# Altium schematic sheet 4GModule-EC25.SchDoc
size A2
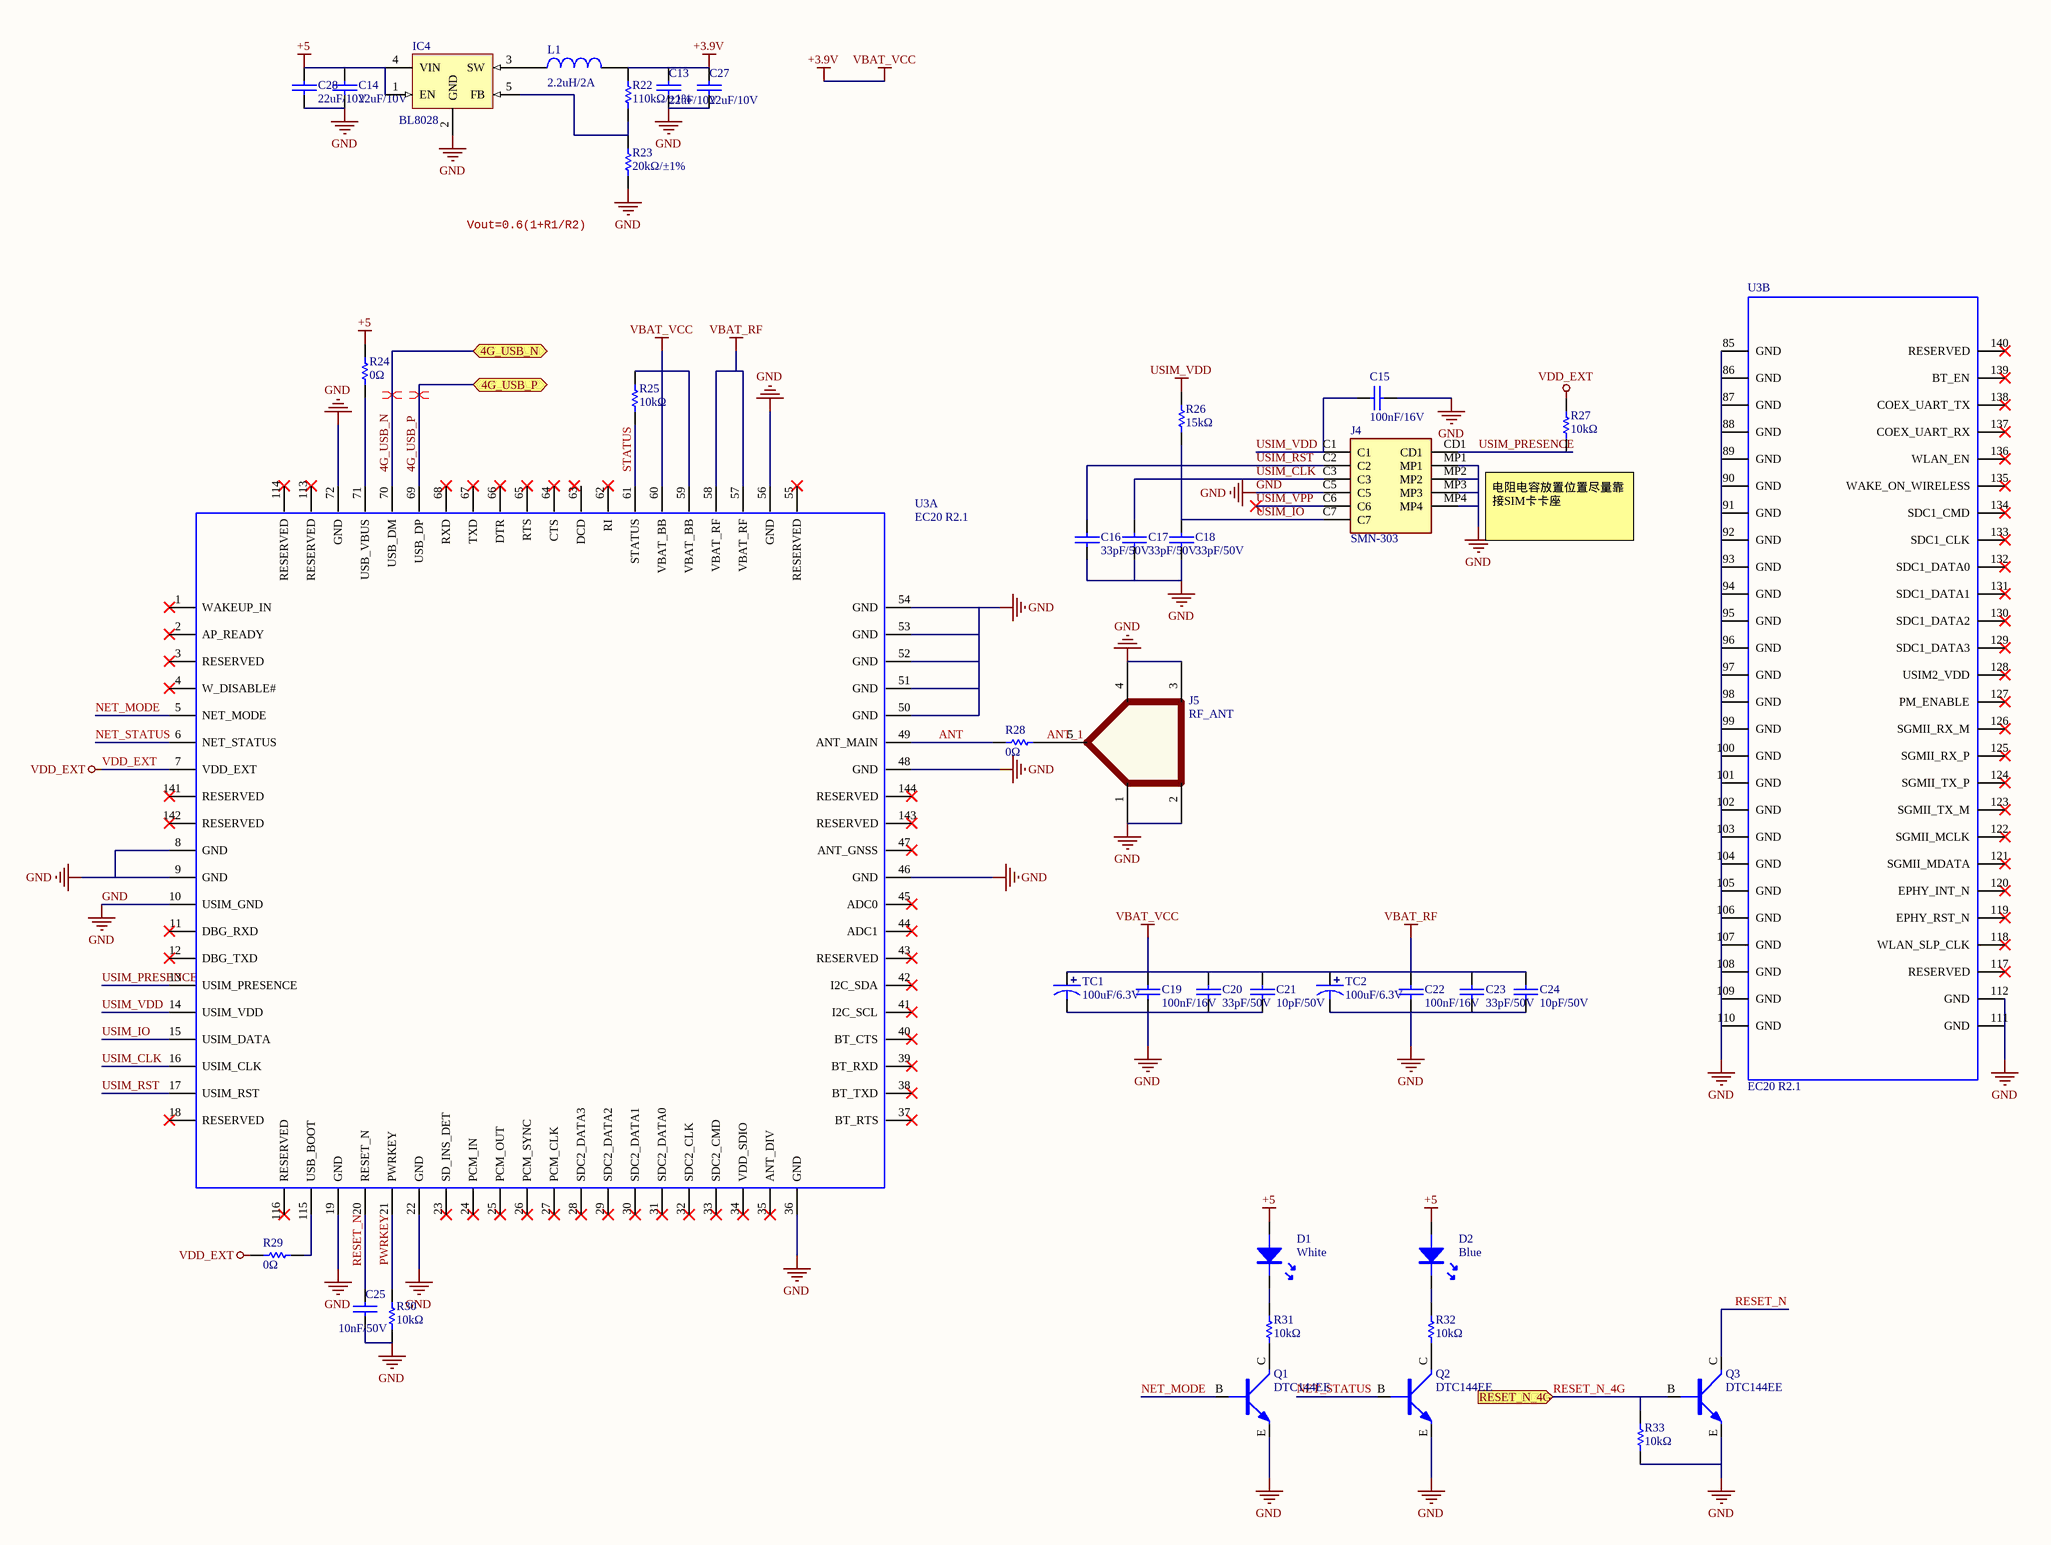
[diagram p0: 4GModule-EC25.SchDoc]

## Parts
C13  22uF/10V  [C_0603]
C14  22uF/10V  [C_0603]
C15  100nF/16V  [C_0402]
C16  33pF/50V  [C_0402]
C17  33pF/50V  [C_0402]
C18  33pF/50V  [C_0402]
C19  100nF/16V  [C_0402]
C20  33pF/50V  [C_0402]
C21  10pF/50V  [C_0402]
C22  100nF/16V  [C_0402]
C23  33pF/50V  [C_0402]
C24  10pF/50V  [C_0402]
C25  10nF/50V  [C_0402]
C27  22uF/10V  [C_0603]
C28  22uF/10V  [C_0603]
D1  White  [LED-0603-W]
D2  Blue  [LED-0603-B]
IC4  BL8028  [SOT23-5]
J4  SMN-303  [SimCard_SMN-303]
J5  RF_ANT  [RF_MCX]
L1  2.2uH/2A  [L_1008]
Q1  DTC144EE  [SOT-523]
Q2  DTC144EE  [SOT-523]
Q3  DTC144EE  [SOT-523]
R22  110kΩ/±1%  [R_0402]
R23  20kΩ/±1%  [R_0402]
R24  0Ω  [R_0402]
R25  10kΩ  [R_0402]
R26  15kΩ  [R_0402]
R27  10kΩ  [R_0402]
R28  0Ω  [R_0402]
R29  0Ω  [R_0402]
R30  10kΩ  [R_0402]
R31  10kΩ  [R_0402]
R32  10kΩ  [R_0402]
R33  10kΩ  [R_0402]
TC1  100uF/6.3V  [TAJ-B/3528]
TC2  100uF/6.3V  [TAJ-B/3528]
U3  EC20 R2.1  [LCC-144_29.0X32.0X1.3P]  (parts A,B of 2)

## Ports
4G_USB_N (bidir), 4G_USB_P (bidir), RESET_N_4G (in)

## Nets
+3.9V: C13.2 C19.2 C20.2 C21.2 C22.2 C23.2 C24.2 C27.2 L1.2 R22.2 R25.2 TC1.1 TC2.1 U3.57(VBAT_RF) U3.58(VBAT_RF) U3.59(VBAT_BB) U3.60(VBAT_BB)  [also labelled VBAT_RF, VBAT_VCC]
+5: C14.2 C28.2 D1.A D2.A IC4.1(EN) IC4.4(VIN) R24.2
GND: C13.1 C14.1 C15.1 C16.1 C17.1 C18.1 C19.1 C20.1 C21.1 C22.1 C23.1 C24.1 C25.1 C27.1 C28.1 IC4.2(GND) J4.C5 J4.MP1 J4.MP2 J4.MP3 J4.MP4 J5.1 J5.2 J5.3 J5.4 Q1.E Q2.E Q3.E R23.1 R30.1 R33.1 TC1.2 TC2.2 U3.8(GND) U3.9(GND) U3.10(USIM_GND) U3.19(GND) U3.22(GND) U3.36(GND) U3.46(GND) U3.48(GND) U3.50(GND) U3.51(GND) U3.52(GND) U3.53(GND) U3.54(GND) U3.56(GND) U3.72(GND) U3.85(GND) U3.86(GND) U3.87(GND) U3.88(GND) U3.89(GND) U3.90(GND) U3.91(GND) U3.92(GND) U3.93(GND) U3.94(GND) U3.95(GND) U3.96(GND) U3.97(GND) U3.98(GND) U3.99(GND) U3.100(GND) U3.101(GND) U3.102(GND) U3.103(GND) U3.104(GND) U3.105(GND) U3.106(GND) U3.107(GND) U3.108(GND) U3.109(GND) U3.110(GND) U3.111(GND) U3.112(GND)
USIM_VDD: C15.2 J4.C1 R26.2 U3.14(USIM_VDD)
VDD_EXT: R27.2 R29.2 U3.7(VDD_EXT)
4G_USB_N: U3.70(USB_DM) ; port 4G_USB_N
4G_USB_P: U3.69(USB_DP) ; port 4G_USB_P
ANT: R28.1 U3.49(ANT_MAIN)
ANT_1: J5.5 R28.2
NET_MODE: Q1.B U3.5(NET_MODE)
NET_STATUS: Q2.B U3.6(NET_STATUS)
PWRKEY: R30.2 U3.21(PWRKEY)
RESET_N: C25.2 Q3.C U3.20(RESET_N)
RESET_N_4G: Q3.B R33.2 ; port RESET_N_4G
STATUS: R25.1 U3.61(STATUS)
USIM_CLK: C17.2 J4.C3 U3.16(USIM_CLK)
USIM_IO: C18.2 J4.C7 R26.1 U3.15(USIM_DATA)
USIM_PRESENCE: J4.CD1 R27.1 U3.13(USIM_PRESENCE)
USIM_RST: C16.2 J4.C2 U3.17(USIM_RST)
USIM_VPP: J4.C6
NetD1_K: D1.K R31.2
NetD2_K: D2.K R32.2
NetIC4_3: IC4.3(SW) L1.1
NetIC4_5: IC4.5(FB) R22.1 R23.2
NetQ1_C: Q1.C R31.1
NetQ2_C: Q2.C R32.1
NetR24_1: R24.1 U3.71(USB_VBUS)
NetR29_1: R29.1 U3.115(USB_BOOT)

Not connected (* = marked no-connect by the designer): U3 1(WAKEUP_IN)* 2(AP_READY)* 3(RESERVED)* 4(W_DISABLE#)* 11(DBG_RXD)* 12(DBG_TXD)* 18(RESERVED)* 23(SD_INS_DET)* 24(PCM_IN)* 25(PCM_OUT)* 26(PCM_SYNC)* 27(PCM_CLK)* 28(SDC2_DATA3)* 29(SDC2_DATA2)* 30(SDC2_DATA1)* 31(SDC2_DATA0)* 32(SDC2_CLK)* 33(SDC2_CMD)* 34(VDD_SDIO)* 35(ANT_DIV)* 37(BT_RTS)* 38(BT_TXD)* 39(BT_RXD)* 40(BT_CTS)* 41(I2C_SCL)* 42(I2C_SDA)* 43(RESERVED)* 44(ADC1)* 45(ADC0)* 47(ANT_GNSS)* 55(RESERVED)* 62(RI)* 63(DCD) 64(CTS)* 65(RTS)* 66(DTR)* 67(TXD)* 68(RXD)* 113(RESERVED)* 114(RESERVED)* 116(RESERVED)* 117(RESERVED)* 118(WLAN_SLP_CLK)* 119(EPHY_RST_N)* 120(EPHY_INT_N)* 121(SGMII_MDATA)* 122(SGMII_MCLK)* 123(SGMII_TX_M)* 124(SGMII_TX_P)* 125(SGMII_RX_P)* 126(SGMII_RX_M)* 127(PM_ENABLE)* 128(USIM2_VDD)* 129(SDC1_DATA3)* 130(SDC1_DATA2)* 131(SDC1_DATA1)* 132(SDC1_DATA0)* 133(SDC1_CLK)* 134(SDC1_CMD)* 135(WAKE_ON_WIRELESS)* 136(WLAN_EN)* 137(COEX_UART_RX)* 138(COEX_UART_TX)* 139(BT_EN)* 140(RESERVED)* 141(RESERVED)* 142(RESERVED)* 143(RESERVED)* 144(RESERVED)*

## Layout directives
differential pair: 4G_USB_N, 4G_USB_P

## Notes on the sheet
- Vout=0.6(1+R1/R2)
- 电阻电容放置位置尽量靠接SIM卡卡座

## Library data of the parts
C13-C25 C27 C28 = Cap_MLCC: 贴片电容; 厂家型号: *; 商品编号: *
D1 D2 = LED_SMD: 贴片LED; 厂家型号: *; 商品编号: *
IC4 = BL8028: DC-DC 芯片
J4 = SimCard_Nano: NANO SIM卡座; Manufacturer_Part_Number: SMN-303; 厂家型号: *; 商品编号: *
J5 = RF_ANT: RF 天线座
L1 = Ind_SMD: 小功率贴片电感; 厂家型号: DFE2520124-H-2R2M; 商品编号: C161086
Q1-Q3 = BJT_NPN: NPN三极管; 厂家编号: *; 商品编号: *
R22-R33 = Res_SMD: 贴片电阻; 商品编号: *; 厂家型号: *
TC1 TC2 = Cap_TAN: 钽电容; 厂家型号: *; 商品编号: *
U3 = Module_EC20-R2.1: EC20邮票孔模组; Value: *; Part Description: *; PCB DECAL: *